# EAGLE design R141C (EAGLE 6.6.0)
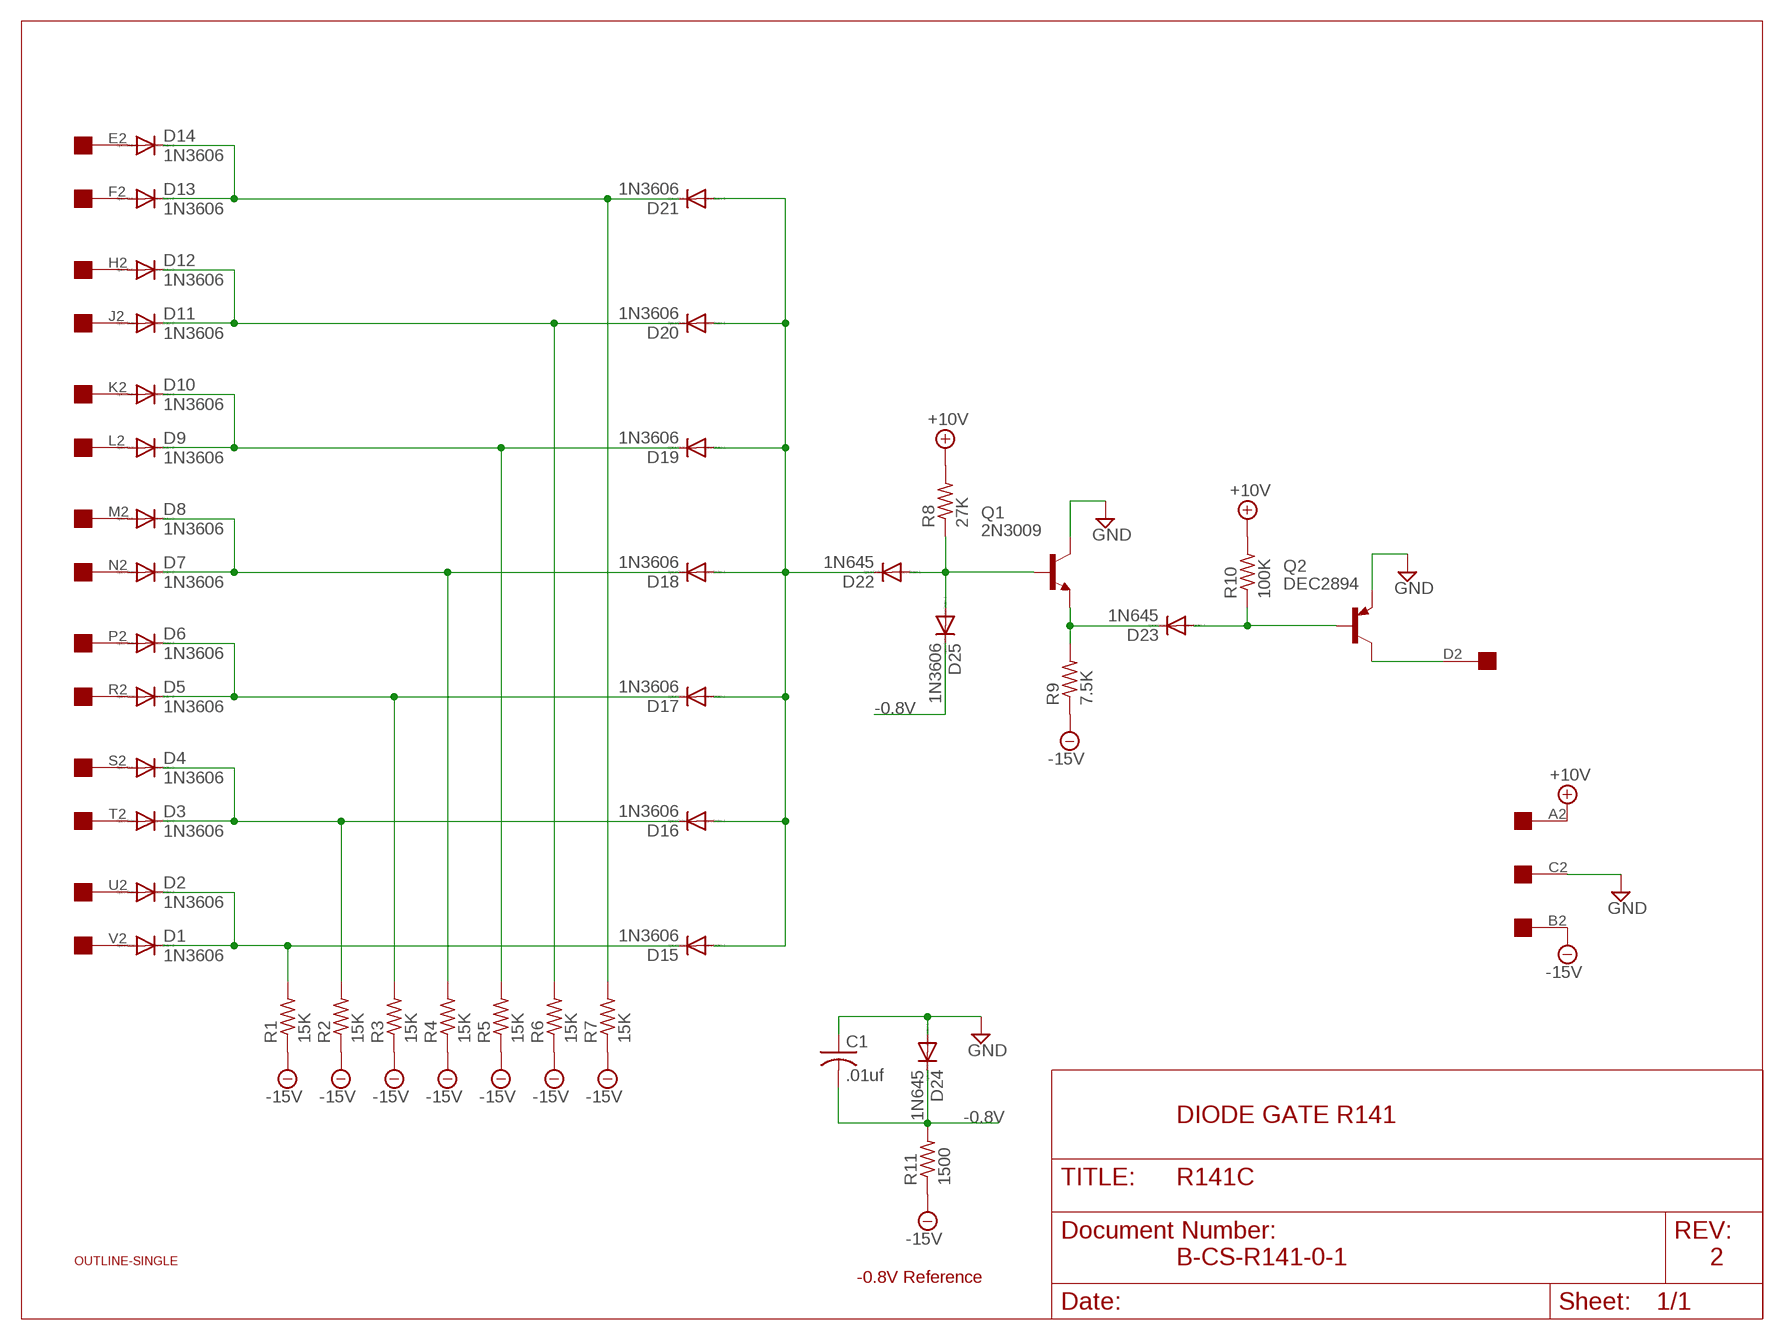
[diagram p0: schematic, sheet 1]

## Parts
C1  .01uf  C-US  [C063-025X075]
D1  1N3606  1N4148DO35-10  [DO35-10]
D2  1N3606  1N4148DO35-10  [DO35-10]
D3  1N3606  1N4148DO35-10  [DO35-10]
D4  1N3606  1N4148DO35-10  [DO35-10]
D5  1N3606  1N4148DO35-10  [DO35-10]
D6  1N3606  1N4148DO35-10  [DO35-10]
D7  1N3606  1N4148DO35-10  [DO35-10]
D8  1N3606  1N4148DO35-10  [DO35-10]
D9  1N3606  1N4148DO35-10  [DO35-10]
D10  1N3606  1N4148DO35-10  [DO35-10]
D11  1N3606  1N4148DO35-10  [DO35-10]
D12  1N3606  1N4148DO35-10  [DO35-10]
D13  1N3606  1N4148DO35-10  [DO35-10]
D14  1N3606  1N4148DO35-10  [DO35-10]
D15  1N3606  1N4148DO35-10  [DO35-10]
D16  1N3606  1N4148DO35-10  [DO35-10]
D17  1N3606  1N4148DO35-10  [DO35-10]
D18  1N3606  1N4148DO35-10  [DO35-10]
D19  1N3606  1N4148DO35-10  [DO35-10]
D20  1N3606  1N4148DO35-10  [DO35-10]
D21  1N3606  1N4148DO35-10  [DO35-10]
D22  1N645  1N4148DO35-10  [DO35-10]
D23  1N645  1N4148DO35-10  [DO35-10]
D24  1N645  1N4148DO35-10  [DO35-10]
D25  1N3606  1N4148DO35-10  [DO35-10]
Q1  2N3009  2N3019-NPN-TO39-EBC  [TO39]
Q2  DEC2894  2N3637  [TO39]
R1  15K  R-US_0207/10  [0207/10]
R2  15K  R-US_0207/10  [0207/10]
R3  15K  R-US_0207/10  [0207/10]
R4  15K  R-US_0207/10  [0207/10]
R5  15K  R-US_0207/10  [0207/10]
R6  15K  R-US_0207/10  [0207/10]
R7  15K  R-US_0207/10  [0207/10]
R8  27K  R-US_0207/10  [0207/10]
R9  7.5K  R-US_0207/10  [0207/10]
R10  100K  R-US_0207/10  [0207/10]
R11  1500  R-US_0207/10  [0207/10]
U$1  OUTLINE-SINGLE  [SINGLE]
U$2  EDGE-1  [EDGE-CON1]

## Nets
+10V [Power]: R8.2 R10.2 U$2.A2
-0.8V [Power]: C1.2 D24.C D25.C R11.2
-15V [Power]: R1.1 R2.1 R3.1 R4.1 R5.1 R6.1 R7.1 R9.1 R11.1 U$2.B2
GND [Power]: C1.1 D24.A Q1.3(C) Q2.1(E) U$2.C2
N$1: D4.A U$2.S2
N$2: D23.A Q2.2(B) R10.1
N$3: D22.A D25.A Q1.2(B) R8.1
N$4: Q2.3(C) U$2.D2
N$5: D11.A U$2.J2
N$6: D11.C D12.C D20.C R6.2
N$7: D10.A U$2.K2
N$8: D2.A U$2.U2
N$9: D8.A U$2.M2
N$10: D9.A U$2.L2
N$11: D9.C D10.C D19.C R5.2
N$12: D6.A U$2.P2
N$13: D23.C Q1.1(E) R9.2
N$14: D1.A U$2.V2
N$15: D15.A D16.A D17.A D18.A D19.A D20.A D21.A D22.C
N$17: D1.C D2.C D15.C R1.2
N$20: D14.A U$2.E2
N$21: D13.A U$2.F2
N$22: D13.C D14.C D21.C R7.2
N$23: D12.A U$2.H2
N$26: D7.A U$2.N2
N$27: D7.C D8.C D18.C R4.2
N$31: D5.A U$2.R2
N$32: D5.C D6.C D17.C R3.2
N$36: D3.A U$2.T2
N$37: D3.C D4.C D16.C R2.2

## Notes on the sheet
- DIODE GATE R141
- B-CS-R141-0-1 | 2
- -0.8V Reference

## Library data of the parts
C1 = dec-con:C-US: Capacitors with funky DEC lead spacing.
D1-D25 = diode:1N4148: DIODE high speed (Philips)
Q1 = transistor:*-NPN-: NPN Transistror BF959 corrected 2008.03.06
Q2 = transistor-pnp:2N3637*: PNP Transistror
R1-R11 = rcl:R-US_: RESISTOR, American symbol
U$1 = dec-con:OUTLINE-*: Board outlines for DEC boards.
U$2 = dec-con:EDGE-1: Single-Sided DEC Edge Connector -- (side 2)

## Net classes
1 Power: width 0.813 mm

## Board
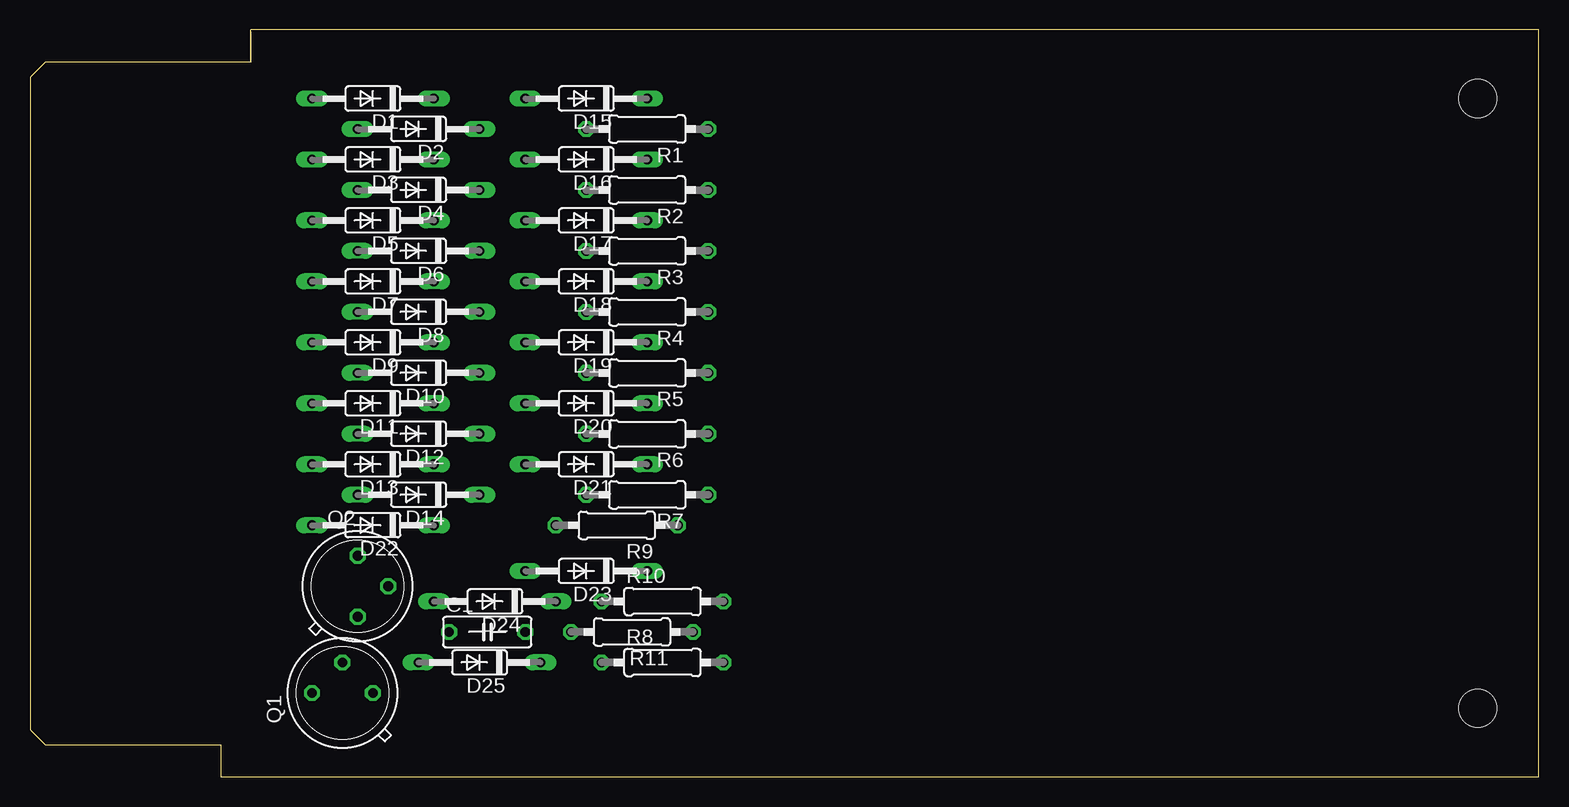
[diagram p1: board, top side]
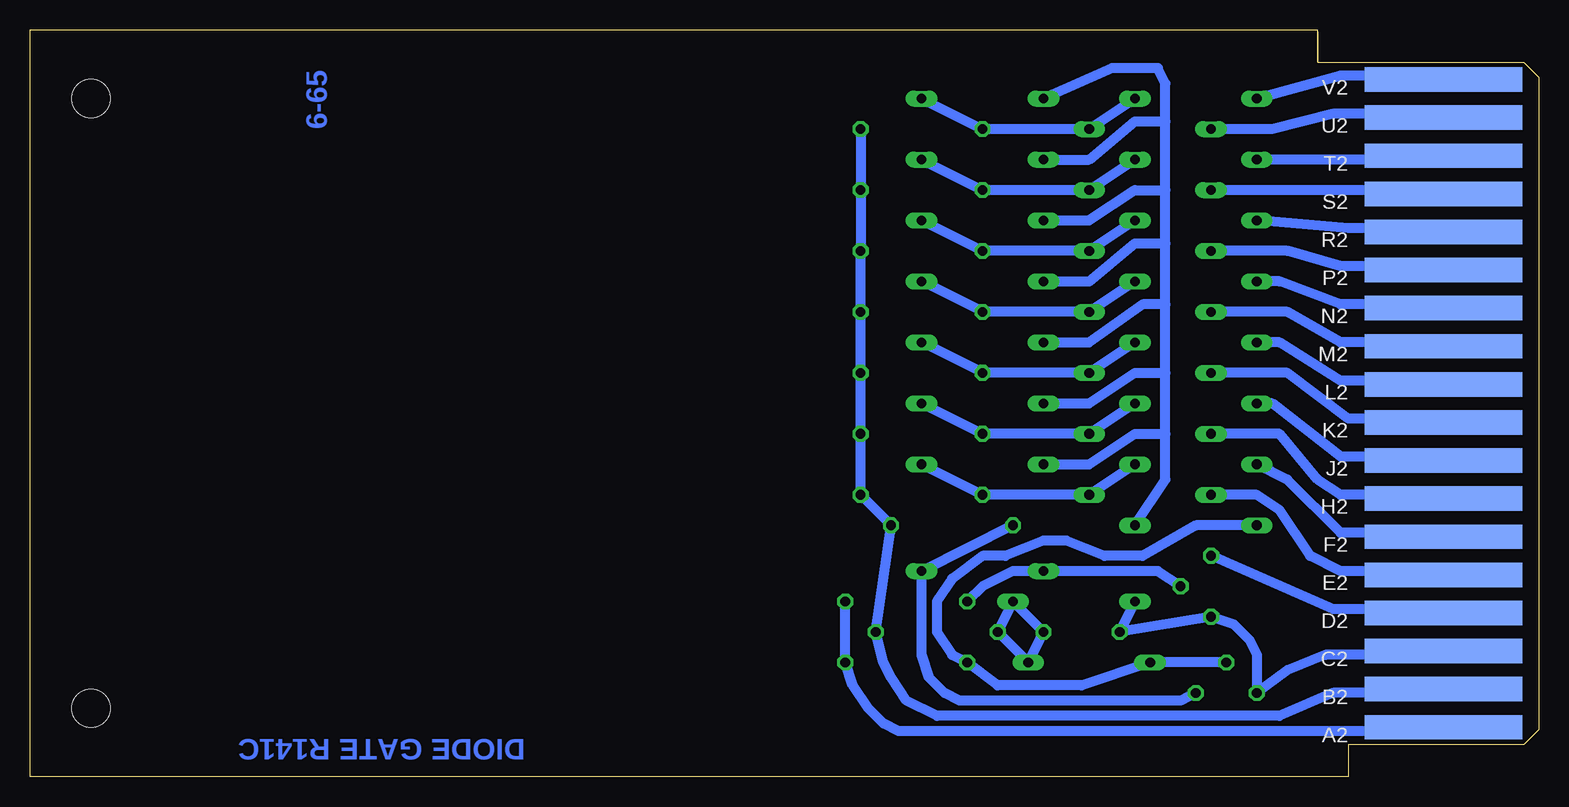
[diagram p2: board, bottom side, seen from below]

Size 125.73 x 62.23 mm. Coordinates in mm from the lower left corner, seen from the top.
Copper layers (1+16): Top 0.035mm / dielectric 1.5mm / Bottom 0.035mm
Design rules "16mils": minimum track width 16mil, minimum drill 32mil, track to track 15mil, track to pad 10mil, pad to pad 10mil, via to via 10mil, smd to smd 10mil, copper to edge 13mil, drill to drill 10mil, minimum pad ring 10mil, minimum via ring 8mil, stop-mask expansion 0mil, vias tented up to drill 0mil, thermal gap 10mil

### Footprints (pad centres in the part's own frame; a part is rotated, then mirrored left to right if it is on the bottom)
C063-025X075 = drill 0.813 octagon: 1 -2.54,0; 2 3.81,0
DO35-10 = drill 0.813 long: A 5.08,0; C -5.08,0
TO39 = drill 0.813 octagon: 1 0,-2.54; 2 2.54,0; 3 0,2.54
0207/10 = drill 0.813 octagon: 1 -5.08,0; 2 5.08,0
SINGLE = hole 3.175: 120.65,56.515; 120.65,5.715
EDGE-CON1 = smd 13.106 x 2.032 bottom: A2 7.938,4.128; B2 7.938,7.303; C2 7.938,10.477; D2 7.938,13.652; E2 7.938,16.828; F2 7.938,20.003; H2 7.938,23.177; J2 7.938,26.352; K2 7.938,29.527; L2 7.938,32.703; M2 7.938,35.877; N2 7.938,39.053; P2 7.938,42.227; R2 7.938,45.403; S2 7.938,48.578; T2 7.938,51.752; U2 7.938,54.928; V2 7.938,58.102

### Placement (x,y rotation side)
C1  37.47,12.06 0 top
D1  28.58,56.52 180 top
D2  32.39,53.98 180 top
D3  28.58,51.44 180 top
D4  32.39,48.9 180 top
D5  28.58,46.35 180 top
D6  32.39,43.81 180 top
D7  28.58,41.27 180 top
D8  32.39,38.73 180 top
D9  28.58,36.2 180 top
D10  32.39,33.66 180 top
D11  28.58,31.11 180 top
D12  32.39,28.57 180 top
D13  28.58,26.04 180 top
D14  32.39,23.5 180 top
D15  46.36,56.52 180 top
D16  46.36,51.44 180 top
D17  46.36,46.35 180 top
D18  46.36,41.27 180 top
D19  46.36,36.2 180 top
D20  46.36,31.11 180 top
D21  46.36,26.04 180 top
D22  28.58,20.95 180 top
D23  46.36,17.14 180 top
D24  38.74,14.61 180 top
D25  37.47,9.53 180 top
Q1  26.04,6.99 90 top
Q2  27.31,15.88 0 top
R1  51.44,53.98 180 top
R2  51.44,48.9 180 top
R3  51.44,43.81 180 top
R4  51.44,38.73 180 top
R5  51.44,33.66 180 top
R6  51.44,28.57 180 top
R7  51.44,23.5 180 top
R8  52.71,9.53 0 top
R9  48.9,20.95 180 top
R10  52.71,14.61 0 top
R11  50.17,12.06 180 top
U$1  0,0 0 top
U$2  0,0 0 top

### Tracks (layer width: path | path; a pad name or v marks a point on that pad's centre or on a via)
+10V
  Bottom 0.813: R10.2 R8.2 57.15,7.62 55.88,5.71 54.61,4.45 53.34,3.81 8.26,3.81 U$2.A2
-0.8V
  Bottom 0.813: D24.C R11.2 D25.C C1.2 D24.C
-15V
  Bottom 0.813: R1.1 R2.1 R3.1 R4.1 R5.1 R6.1 R7.1 R9.1 R11.1 54.61,9.53 53.98,8.26 52.71,6.35 50.17,5.08 21.59,5.08 17.15,6.99 8.89,6.99 U$2.B2
GND
  Bottom 0.813: D24.A C1.1 Q2.1 25.4,12.7 24.13,11.43 23.5,10.16 Q1.3 20.96,8.89 17.78,10.16 8.89,10.16 U$2.C2
N$1
  Bottom 0.813: U$2.S2 9.53,48.9 D4.A
N$2
  Bottom 0.813: Q2.2 31.75,17.14 D23.A 43.82,17.14 46.36,15.88 R10.1
N$3
  Bottom 0.813: Q1.2 D25.A 38.1,7.62 45.09,7.62 R8.1 48.9,10.16 50.17,12.06 50.17,14.61 48.9,16.51 46.36,18.41 44.45,18.41 41.28,19.68 39.37,19.68 36.2,18.41 33.02,18.41 28.58,20.95 D22.A
N$4
  Bottom 0.813: U$2.D2 9.53,13.97 17.15,13.97 Q2.3
N$5
  Bottom 0.813: U$2.J2 9.53,26.67 16.51,26.67 22.23,31.11 D11.A
N$6
  Bottom 0.813: D11.C D12.C R6.2 D20.C
N$7
  Bottom 0.813: U$2.K2 8.89,29.84 15.88,29.84 20.96,33.66 D10.A
N$8
  Bottom 0.813: U$2.U2 8.26,55.24 17.15,55.24 22.23,53.98 D2.A
N$9
  Bottom 0.813: U$2.M2 8.26,36.2 16.51,36.2 20.96,38.73 D8.A
N$10
  Bottom 0.813: U$2.L2 8.89,33.02 16.51,33.02 21.59,36.2 D9.A
N$11
  Bottom 0.813: D19.C R5.2 D10.C D9.C
N$12
  Bottom 0.813: U$2.P2 10.8,42.55 16.51,42.55 20.96,43.81 D6.A
N$13
  Bottom 0.813: R9.2 D23.C 51.44,10.16 50.8,8.26 49.53,6.99 48.26,6.35 29.85,6.35 Q1.1
N$14
  Bottom 0.813: U$2.V2 9.53,58.42 16.51,58.42 D1.A
N$15
  Bottom 0.813: D22.C 31.12,24.77 31.12,28.57 | 31.12,28.57 31.12,33.66 | 31.12,33.66 31.12,39.37 | 31.12,39.37 31.12,44.45 | 31.12,44.45 31.12,48.9 | 31.12,48.9 31.12,54.61 | 31.12,54.61 31.12,57.78 31.75,59.05 35.56,59.05 D15.A | D16.A 37.47,51.44 33.66,54.61 31.12,54.61 | D17.A 37.47,46.35 33.66,48.9 31.12,48.9 | D18.A 37.47,41.27 33.66,44.45 31.12,44.45 | D19.A 37.47,36.2 33.02,39.37 31.12,39.37 | D21.A 37.47,26.04 33.66,28.57 31.12,28.57 | D20.A 37.47,31.11 33.66,33.66 31.12,33.66
N$17
  Bottom 0.813: D1.C D2.C R1.2 D15.C
N$20
  Bottom 0.813: U$2.E2 8.89,17.14 16.51,17.14 19.05,18.41 21.59,22.23 23.5,23.5 D14.A
N$21
  Bottom 0.813: U$2.F2 8.89,20.32 16.51,20.32 20.96,24.77 D13.A
N$22
  Bottom 0.813: D13.C D14.C R7.2 D21.C
N$23
  Bottom 0.813: U$2.H2 8.89,23.5 16.51,23.5 18.42,24.77 21.59,28.57 D12.A
N$26
  Bottom 0.813: U$2.N2 11.43,39.37 16.51,39.37 21.59,41.27 D7.A
N$27
  Bottom 0.813: D7.C D8.C R4.2 D18.C
N$31
  Bottom 0.813: U$2.R2 10.16,45.72 15.88,45.72 D5.A
N$32
  Bottom 0.813: D17.C R3.2 D6.C D5.C
N$36
  Bottom 0.813: U$2.T2 8.89,51.44 D3.A
N$37
  Bottom 0.813: D16.C R2.2 D4.C D3.C

### Text on the board
Bottom: 6-65 | DIODE GATE R141C